# Altium schematic sheet mcu.SchDoc: schematic template
size 420 x 297 mm; Date: 2021-12-08; Author: Joachim Löfwander; Revision: ABC-123; SheetNumber: 3; SheetTotal: 4; Website: jlofw.com
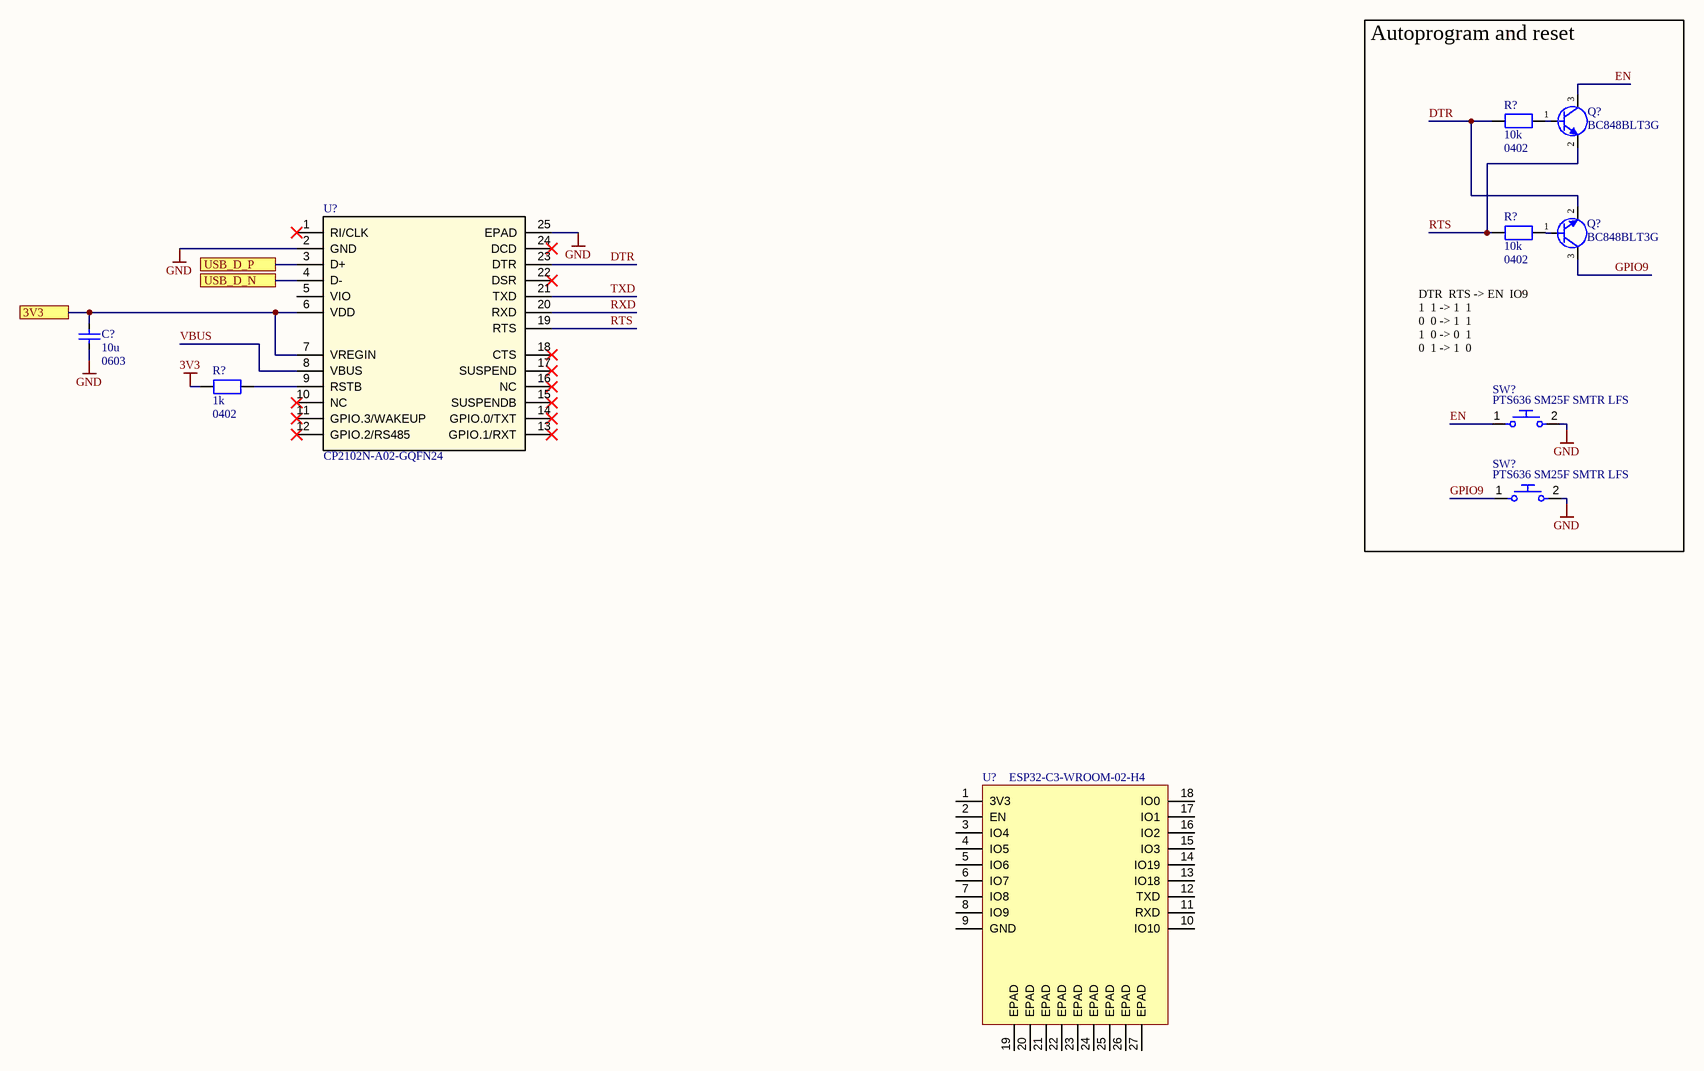
[diagram p0: mcu.SchDoc]

## Parts
(Parts that share a designator on the sheet are numbered #1, #2 ... from top to bottom, then left to right.)
C?  value 10u  Package: 0603  [C_0603_1608Metric_IPCB]  (hidden comment: Capacitor_Ceramic)
Q?#1  Manufacturer P/N: BC848BLT3G  [SOT23-3_Standard_IPCB]  (hidden comment: BJT_NPN_BEC)
Q?#2  Manufacturer P/N: BC848BLT3G  [SOT23-3_Standard_IPCB]  (hidden comment: BJT_NPN_BEC)
R?#1  value 10k  Package: 0402  [R_0402_1005Metric_IPCB]  (hidden comment: Resistor)
R?#2  value 10k  Package: 0402  [R_0402_1005Metric_IPCB]  (hidden comment: Resistor)
R?#3  value 1k  Package: 0402  [R_0402_1005Metric_IPCB]  (hidden comment: Resistor)
SW?#1  Manufacturer P/N: PTS636 SM25F SMTR LFS  [Pushbutton_PTS636_SM25F_SMTR_LFS]  (hidden comment: SW_Single_NO_BridgingPads)
SW?#2  Manufacturer P/N: PTS636 SM25F SMTR LFS  [Pushbutton_PTS636_SM25F_SMTR_LFS]  (hidden comment: SW_Single_NO_BridgingPads)
U?#1  Manufacturer P/N: CP2102N-A02-GQFN24  [CP2102N_QFN24]  (hidden comment: CP2102N_QFN24)
U?#2  ESP32-C3-WROOM-02-H4  [ESP32-C3-WROOM-02-H4]

## Blocks framed on the sheet
Autoprogram and reset: Q?#1 Q?#2 R?#1 R?#2 SW?#1 SW?#2

## Ports
3V3, USB_D_N, USB_D_P

## Nets
3V3: R?#3.1
GND: C?.1 SW?#1.2 SW?#2.2 U?#1.2(GND) U?#1.25(EPAD)
3V3: C?.2 U?#1.6(VDD) U?#1.7(VREGIN) ; port 3V3  [a separate net that carries the same name]
DTR: Q?#2.2(E) R?#1.1 U?#1.23(DTR)
EN: Q?#1.3(C) SW?#1.1
GPIO9: Q?#2.3(C) SW?#2.1
RTS: Q?#1.2(E) R?#2.1 U?#1.19(RTS)
RXD: U?#1.20(RXD)
TXD: U?#1.21(TXD)
USB_D_N: U?#1.4(D-) ; port USB_D_N
USB_D_P: U?#1.3(D+) ; port USB_D_P
VBUS: U?#1.8(VBUS)
NetQ?#1_1: Q?#1.1(B) R?#1.2
NetQ?#2_1: Q?#2.1(B) R?#2.2
NetR?#3_2: R?#3.2 U?#1.9(RSTB)

Not connected (* = marked no-connect by the designer): U?#1 1(RI/CLK)* 5(VIO) 10(NC)* 11(GPIO.3/WAKEUP)* 12(GPIO.2/RS485)* 13(GPIO.1/RXT)* 14(GPIO.0/TXT)* 15(SUSPENDB)* 16(NC)* 17(SUSPEND)* 18(CTS)* 22(DSR)* 24(DCD)*; U?#2 1(3V3) 2(EN) 3(IO4) 4(IO5) 5(IO6) 6(IO7) 7(IO8) 8(IO9) 9(GND) 10(IO10) 11(RXD) 12(TXD) 13(IO18) 14(IO19) 15(IO3) 16(IO2) 17(IO1) 18(IO0) 19(EPAD) 20(EPAD) 21(EPAD) 22(EPAD) 23(EPAD) 24(EPAD) 25(EPAD) 26(EPAD) 27(EPAD)

## Notes on the sheet
- DTR  RTS -> EN  IO9
  1  1 -> 1  1
  0  0 -> 1  1
  1  0 -> 0  1
  0  1 -> 1  0
- PROJECT
- TITLE
- FILE NAME
- DATE MODIFIED
- SHEET
- REV
- OF
- AUTHOR
- WEBSITE

## Library data of the parts
C? = 20014: 16V 10u 0603 X5R; Internal Number: 20014
Q?#1 Q?#2 = 50001: TRANS NPN 30V 100MA SOT23-3; Manufacturer: onsemi; Internal Number: 50001; Package: SOT23-3
R?#1 R?#2 = 10033: 0402 10k 1%; Internal Number: 10033
R?#3 = 10009: 0402 1k 1%; Internal Number: 10009
SW?#1 SW?#2 = 100001: Manufacturer: C&K; Internal Number: 100001
U?#1 = 90002: USB to UART; Manufacturer: Silicon Labs; Internal Number: 90002; Package: QFN24
U?#2 = 130001: ESP32 C3 SoC; Internal Number: 130001; Package: SoC